# EAGLE design 8085-lock-schematic (EAGLE 7.3.0)
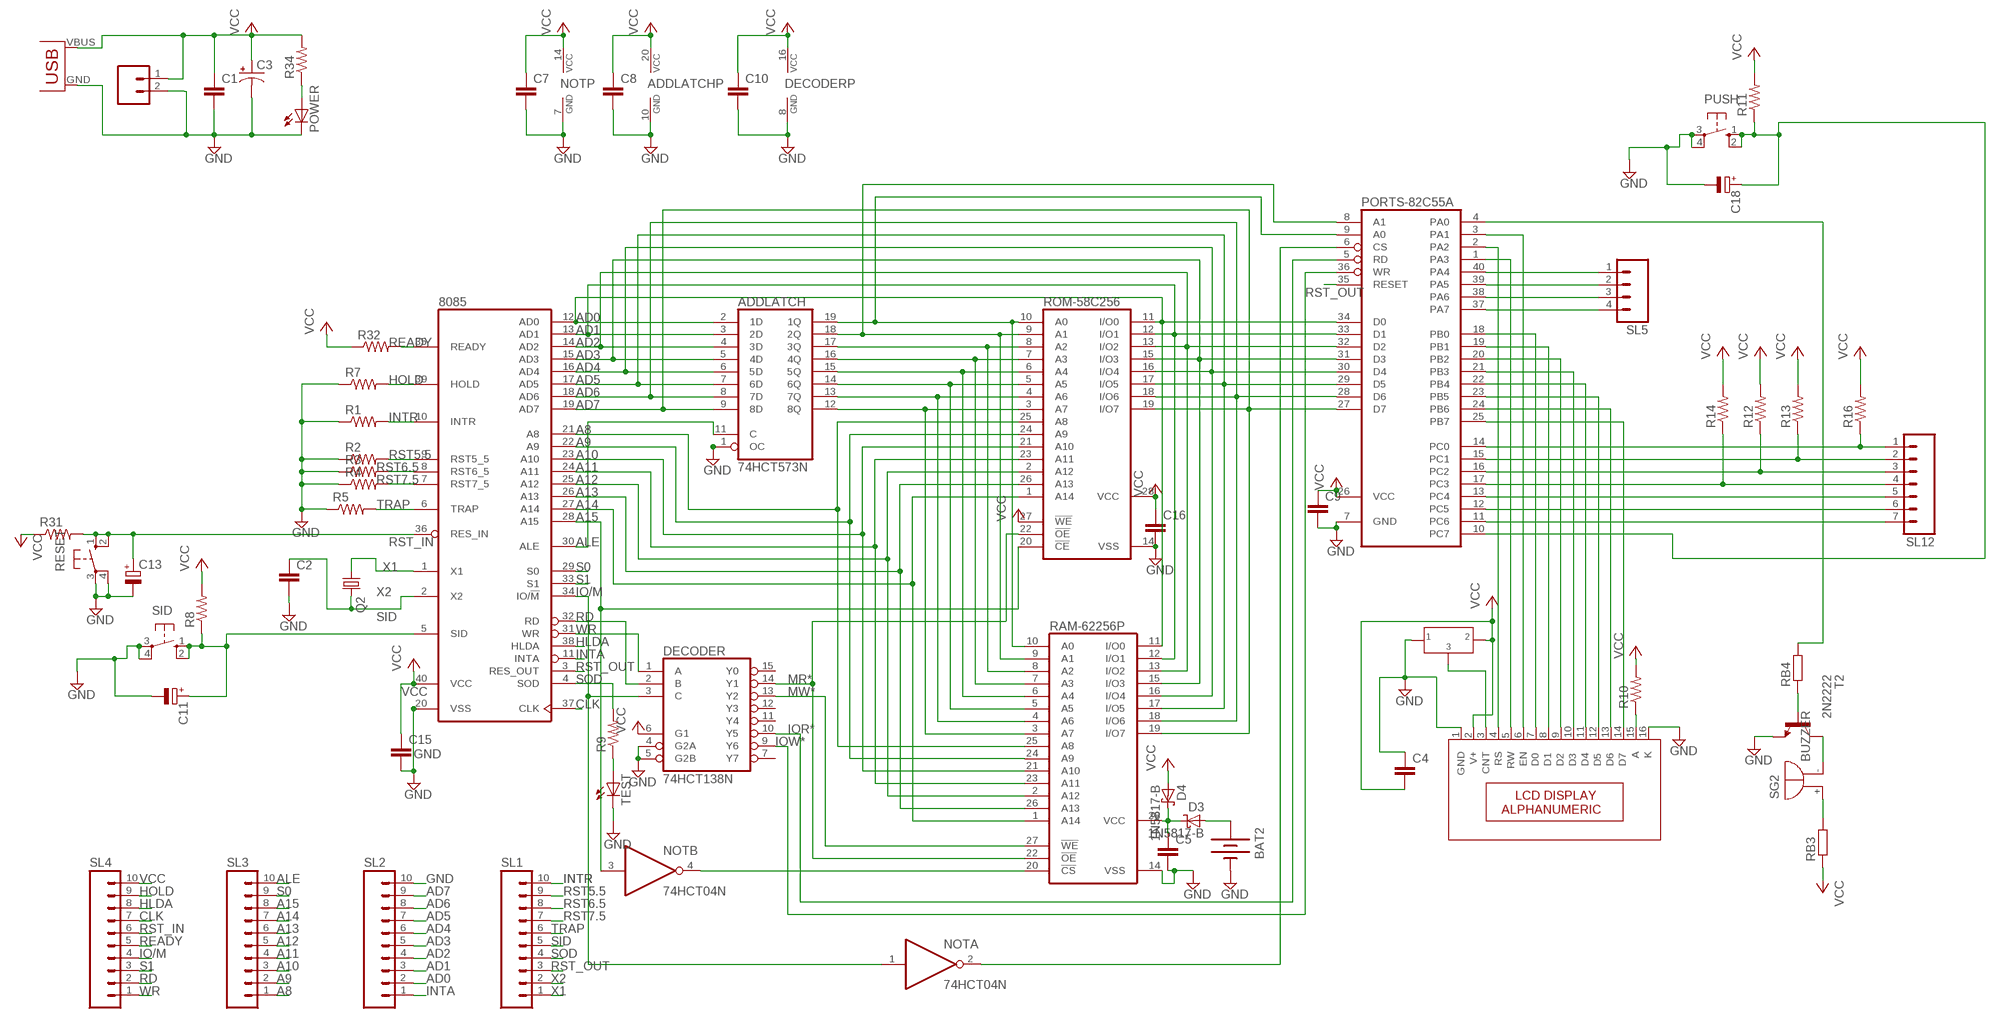
[diagram p0: schematic, sheet 1]

## Parts
8085  8085  [DIL40]
ADDLATCH  74HCT573N  [DIL20]
BAT2  BATTERY20PTH  [BATTCOM_20MM_PTH]
C1  C-EU025-024X044  [C025-024X044]
C2  C-EU025-024X044  [C025-024X044]
C3  CPOL-USE2.5-5  [E2,5-5]
C4  C-EU025-024X044  [C025-024X044]
C5  C-EU025-024X044  [C025-024X044]
C7  C-EU025-024X044  [C025-024X044]
C8  C-EU025-024X044  [C025-024X044]
C9  C-EU025-024X044  [C025-024X044]
C10  C-EU025-024X044  [C025-024X044]
C11  CPOL-EUE2.5-6  [E2,5-6]
C13  CPOL-EUE2.5-6  [E2,5-6]
C15  C-EU025-024X044  [C025-024X044]
C16  C-EU025-024X044  [C025-024X044]
C18  CPOL-EUE2.5-6  [E2,5-6]
D3  1N5817-B  [DO41-7.6]
D4  1N5817-B  [DO41-7.6]
DECODER  74HCT138N  [DIL16]
NOT  74HCT04N  [DIL14]
PORTS-82C55A  82C55A  [DIL40]
POWER  LED5MM  [LED5MM]
PUSH  10-XX  [B3F-10XX]
Q2  CRYSTALHC49US  [HC49US]
R1  R-US_0207/7  [0207/7]
R2  R-US_0207/7  [0207/7]
R3  R-US_0207/7  [0207/7]
R4  R-US_0207/7  [0207/7]
R5  R-US_0207/7  [0207/7]
R6  PRESET_LR  [PRESET_LR]
R7  R-US_0207/7  [0207/7]
R8  R-US_0207/7  [0207/7]
R9  R-US_0207/7  [0207/7]
R10  R-US_0207/7  [0207/7]
R11  R-US_0207/7  [0207/7]
R12  R-US_0207/7  [0207/7]
R13  R-US_0207/7  [0207/7]
R14  R-US_0207/7  [0207/7]
R16  R-US_0207/7  [0207/7]
R31  R-US_0207/7  [0207/7]
R32  R-US_0207/7  [0207/7]
R34  R-US_0207/7  [0207/7]
RAM-62256P  62256P  [DIL28-6]
RB3  R-EU_0204/7  [0204/7]
RB4  R-EU_0204/7  [0204/7]
RESET  10-XX  [B3F-10XX]
ROM-58C256  58C256P  [DIL28-6]
SG2  BUZZER  [F/TMB]
SID  10-XX  [B3F-10XX]
SL1  M10  [10P]
SL2  M10  [10P]
SL3  M10  [10P]
SL4  M10  [10P]
SL5  M04  [04P]
SL12  M07  [07P]
T2  2N2222  [TO18]
TEST  LED5MM  [LED5MM]
U$1  M02  [02P]
U$2  USB(POWER)  [USB(POWER)]
U$3  LCD-16X2  [16X2-LCD-WITH-MOUNT]

## Nets
A8: 8085.21(A8) RAM-62256P.25(A8) ROM-58C256.25(A8) SL3.1
A9: 8085.22(A9) RAM-62256P.24(A9) ROM-58C256.24(A9) SL3.2
A10: 8085.23(A10) RAM-62256P.21(A10) ROM-58C256.21(A10) SL3.3
A11: 8085.24(A11) RAM-62256P.23(A11) ROM-58C256.23(A11) SL3.4
A12: 8085.25(A12) RAM-62256P.2(A12) ROM-58C256.2(A12) SL3.5
A13: 8085.26(A13) RAM-62256P.26(A13) ROM-58C256.26(A13) SL3.6
A14: 8085.27(A14) RAM-62256P.1(A14) ROM-58C256.1(A14) SL3.7
A15: 8085.28(A15) NOT.3(B:I) ROM-58C256.20(!CE) SL3.8
AD0: 8085.12(AD0) ADDLATCH.2(1D) PORTS-82C55A.34(D0) RAM-62256P.11(I/O0) ROM-58C256.11(I/O0) SL2.2
AD1: 8085.13(AD1) ADDLATCH.3(2D) PORTS-82C55A.33(D1) RAM-62256P.12(I/O1) ROM-58C256.12(I/O1) SL2.3
AD2: 8085.14(AD2) ADDLATCH.4(3D) PORTS-82C55A.32(D2) RAM-62256P.13(I/O2) ROM-58C256.13(I/O2) SL2.4
AD3: 8085.15(AD3) ADDLATCH.5(4D) PORTS-82C55A.31(D3) RAM-62256P.15(I/O3) ROM-58C256.15(I/O3) SL2.5
AD4: 8085.16(AD4) ADDLATCH.6(5D) PORTS-82C55A.30(D4) RAM-62256P.16(I/O4) ROM-58C256.16(I/O4) SL2.6
AD5: 8085.17(AD5) ADDLATCH.7(6D) PORTS-82C55A.29(D5) RAM-62256P.17(I/O5) ROM-58C256.17(I/O5) SL2.7
AD6: 8085.18(AD6) ADDLATCH.8(7D) PORTS-82C55A.28(D6) RAM-62256P.18(I/O6) ROM-58C256.18(I/O6) SL2.8
AD7: 8085.19(AD7) ADDLATCH.9(8D) PORTS-82C55A.27(D7) RAM-62256P.19(I/O7) ROM-58C256.19(I/O7) SL2.9
ALE: 8085.30(ALE) ADDLATCH.11(C) SL3.10
BUZZER: PORTS-82C55A.4(PA0) RB4.2
CLK: 8085.37(CLK) SL4.7
GND [GND]: 8085.20(VSS) ADDLATCH.1(OC) ADDLATCH.10(GND) BAT2.2(-) C1.2 C2.2 C3.- C4.1 C5.2 C7.2 C8.2 C9.2 C10.2 C11.- C13.- C15.2 C16.2 C18.- DECODER.4(G2A) DECODER.5(G2B) DECODER.8(GND) NOT.7(P:GND) PORTS-82C55A.7(GND) POWER.K(C) PUSH.3(P) PUSH.4(P1) R1.1 R2.1 R3.1 R4.1 R5.1 R6.P$1 R7.1 RAM-62256P.14(VSS) RESET.3(P) RESET.4(P1) ROM-58C256.14(VSS) SID.3(P) SID.4(P1) SL2.10 T2.1(E) TEST.K(C) U$1.2 U$2.GND U$3.1(GND) U$3.16(K)
HLDA: 8085.38(HLDA) SL4.8
HOLD: 8085.39(HOLD) R7.2 SL4.9
INTA: 8085.11(INTA) SL2.1
INTR: 8085.10(INTR) R1.2 SL1.10
IO/M: 8085.34(IO/!M) DECODER.3(C) NOT.1(A:I) SL4.4
IOR*: DECODER.10(Y5) PORTS-82C55A.5(RD)
IOW*: DECODER.9(Y6) PORTS-82C55A.36(WR)
MR*: DECODER.14(Y1) RAM-62256P.22(!OE) ROM-58C256.22(!OE)
MW*: DECODER.13(Y2) RAM-62256P.27(!WE)
N$1: PORTS-82C55A.14(PC0) R16.1 SL12.1
N$2: PORTS-82C55A.15(PC1) R13.1 SL12.2
N$3: PORTS-82C55A.16(PC2) R12.1 SL12.3
N$4: PORTS-82C55A.17(PC3) R14.1 SL12.4
N$5: PORTS-82C55A.13(PC4) SL12.5
N$6: PORTS-82C55A.12(PC5) SL12.6
N$7: PORTS-82C55A.11(PC6) SL12.7
N$8: PORTS-82C55A.40(PA4) SL5.1
N$9 [VCC]: R10.1 U$3.15(A)
N$10: R6.P$3 U$3.3(CNT)
N$11: C5.1 D3.C D4.C RAM-62256P.28(VCC)
N$12: ADDLATCH.17(3Q) RAM-62256P.8(A2) ROM-58C256.8(A2)
N$13: ADDLATCH.16(4Q) RAM-62256P.7(A3) ROM-58C256.7(A3)
N$14: ADDLATCH.15(5Q) RAM-62256P.6(A4) ROM-58C256.6(A4)
N$15: ADDLATCH.14(6Q) RAM-62256P.5(A5) ROM-58C256.5(A5)
N$16: ADDLATCH.13(7Q) RAM-62256P.4(A6) ROM-58C256.4(A6)
N$17: ADDLATCH.12(8Q) RAM-62256P.3(A7) ROM-58C256.3(A7)
N$18: PORTS-82C55A.39(PA5) SL5.2
N$19: PORTS-82C55A.38(PA6) SL5.3
N$20: PORTS-82C55A.37(PA7) SL5.4
N$23: PORTS-82C55A.25(PB7) U$3.14(D7)
N$25: NOT.2(A:O) PORTS-82C55A.6(CS)
N$26: PORTS-82C55A.2(PA2) U$3.4(RS)
N$28: PORTS-82C55A.1(PA3) U$3.5(RW)
N$37: PORTS-82C55A.24(PB6) U$3.13(D6)
N$43: PORTS-82C55A.23(PB5) U$3.12(D5)
N$44: POWER.A R34.1
N$45: PORTS-82C55A.22(PB4) U$3.11(D4)
N$46: PORTS-82C55A.21(PB3) U$3.10(D3)
N$51: PORTS-82C55A.20(PB2) U$3.9(D2)
N$52: PORTS-82C55A.19(PB1) U$3.8(D1)
N$53: PORTS-82C55A.18(PB0) U$3.7(D0)
N$54: PORTS-82C55A.3(PA1) U$3.6(EN)
N$59: R9.1 TEST.A
N$60: NOT.4(B:O) RAM-62256P.20(!CS)
N$65: ADDLATCH.19(1Q) PORTS-82C55A.9(A0) RAM-62256P.10(A0) ROM-58C256.10(A0)
N$67: ADDLATCH.18(2Q) PORTS-82C55A.8(A1) RAM-62256P.9(A1) ROM-58C256.9(A1)
N$84: BAT2.1(+) D3.A
N$105: RB4.1 T2.2(B)
N$106: SG2.- T2.3(C)
N$107: RB3.2 SG2.+
RD: 8085.32(RD) DECODER.2(B) SL4.2
READY: 8085.35(READY) R32.2 SL4.5
RST5.5: 8085.9(RST5_5) R2.2 SL1.9
RST6.5: 8085.8(RST6_5) R3.2 SL1.8
RST7.5: 8085.7(RST7_5) R4.2 SL1.7
RST_IN: 8085.36(RES_IN) C13.+ R31.2 RESET.1(S) RESET.2(S1) SL4.6
RST_OUT: 8085.3(RES_OUT) PORTS-82C55A.35(RESET) SL1.3
S0: 8085.29(S0) SL3.9
S1: 8085.33(S1) SL4.3
SID [GND]: 8085.5(SID) C11.+ R8.1 SID.1(S) SID.2(S1) SL1.5
SID1 [GND]: C18.+ PORTS-82C55A.10(PC7) PUSH.1(S) PUSH.2(S1) R11.1
SOD: 8085.4(SOD) R9.2 SL1.4
TRAP: 8085.6(TRAP) R5.2 SL1.6
VCC [VCC]: 8085.40(VCC) ADDLATCH.20(VCC) C1.1 C3.+ C4.2 C7.1 C8.1 C9.1 C10.1 C15.1 C16.1 D4.A DECODER.6(G1) DECODER.16(VCC) NOT.14(P:VCC) PORTS-82C55A.26(VCC) R6.P$2 R8.2 R10.2 R11.2 R12.2 R13.2 R14.2 R16.2 R31.1 R32.1 R34.2 RB3.1 ROM-58C256.27(!WE) ROM-58C256.28(VCC) SL4.10 U$1.1 U$2.VBUS(VCC) U$3.2(V+)
WR: 8085.31(WR) DECODER.1(A) SL4.1
X1: 8085.1(X1) Q2.1 SL1.1
X2: 8085.2(X2) C2.1 Q2.2 SL1.2
Unconnected: DECODER.7(Y7) DECODER.11(Y4) DECODER.12(Y3) DECODER.15(Y0) NOT.5(C:I) NOT.6(C:O) NOT.8(D:O) NOT.9(D:I) NOT.10(E:O) NOT.11(E:I) NOT.12(F:O) NOT.13(F:I)

## Library data of the parts
8085 = micro-intel:8085: MICROCOMPUTER/PERIPHERAL DEVICE; OC_FARNELL: unknown; OC_NEWARK: unknown
ADDLATCH = 74xx-eu:74*573: 8-bit D latch BUS DRIVER
BAT2 = SparkFun-Electromechanical:BATTERY: Battery Holders Various common sizes : AA, AAA, 18650 (PRT-12895), 20mm coin cell and 12mm coin cell. 20MM_4LEGS, BATT-10373
C1 C2 C4 C5 C7-C10 C15 C16 = rcl:C-EU: CAPACITOR, European symbol
C3 = 01_adafruit:CPOL-US: POLARIZED CAPACITOR, American symbol
C11 C13 C18 = resistor:CPOL-EU: POLARIZED CAPACITOR, European symbol
D3 D4 = diode:1N581*: 1.0A SCHOTTKY BARRIER RECTIFIER Source: http://www.diodes.com/datasheets/ds23001.pdf
DECODER = 74xx-eu:74*138: 3-line to 8-line DECODER/DEMULTIPLEXER
NOT = 74xx-eu:74*04: Hex INVERTER
PORTS-82C55A = micro-intel:82C55A: MICROCOMPUTER/PERIPHERAL DEVICE; MF: INTERSIL; MPN: IP82C55AZ; OC_FARNELL: 1562050; OC_NEWARK: 79K6939
POWER TEST = CEDTv79:LED
PUSH SID = CEDTv79:10-XX: OMRON SWITCH
Q2 = CEDT:CRYSTAL: Crystals Various standard crystals. Proven footprints. Spark Fun Electronics SKU : COM-00534
R1-R5 R7-R14 R16 R31 R32 R34 = rcl:R-US_: RESISTOR, American symbol
R6 = CEDT_JANUARY_2015:PRESET_LR
RAM-62256P = memory-hitachi:62256P: MEMORY; OC_FARNELL: unknown; OC_NEWARK: unknown
RB3 RB4 = rcl:R-EU_: RESISTOR, European symbol
RESET = CEDT:10-XX: OMRON SWITCH
ROM-58C256 = memory-hitachi:58C256P: MEMORY; MPN: HN58C256AP85E; OC_FARNELL: 1496447; OC_NEWARK: 61M6616
SG2 = CEDT_JANUARY_2015_v5:BUZZER: BUZZER Source: Buerklin; OC_FARNELL: unknown; OC_NEWARK: unknown
SL1-SL4 = con-amp-quick:M10: AMP QUICK CONNECTOR; OC_FARNELL: unknown; OC_NEWARK: unknown
SL5 = con-amp-quick:M04: AMP QUICK CONNECTOR; OC_FARNELL: unknown; OC_NEWARK: unknown
SL12 = con-amp-quick:M07: AMP QUICK CONNECTOR; OC_FARNELL: unknown; OC_NEWARK: unknown
T2 = transistor:2N2222: NPN TRANSISTOR
U$1 = con-amp-quick:M02: AMP QUICK CONNECTOR; OC_FARNELL: unknown; OC_NEWARK: unknown
U$2 = CEDT_JANUARY_2015_v5:USB(POWER)
U$3 = MSP PROJECT LIBRARY:LCD-16X2

## Net classes
0 default: width 0.406 mm, clearance 0.205 mm
1 VCC: width 0.61 mm, clearance 0.205 mm to class 0, clearance 0.205 mm
2 GND: width 0.61 mm, clearance 0.205 mm to class 0, clearance 0.205 mm to class 1, clearance 0.205 mm

## Board
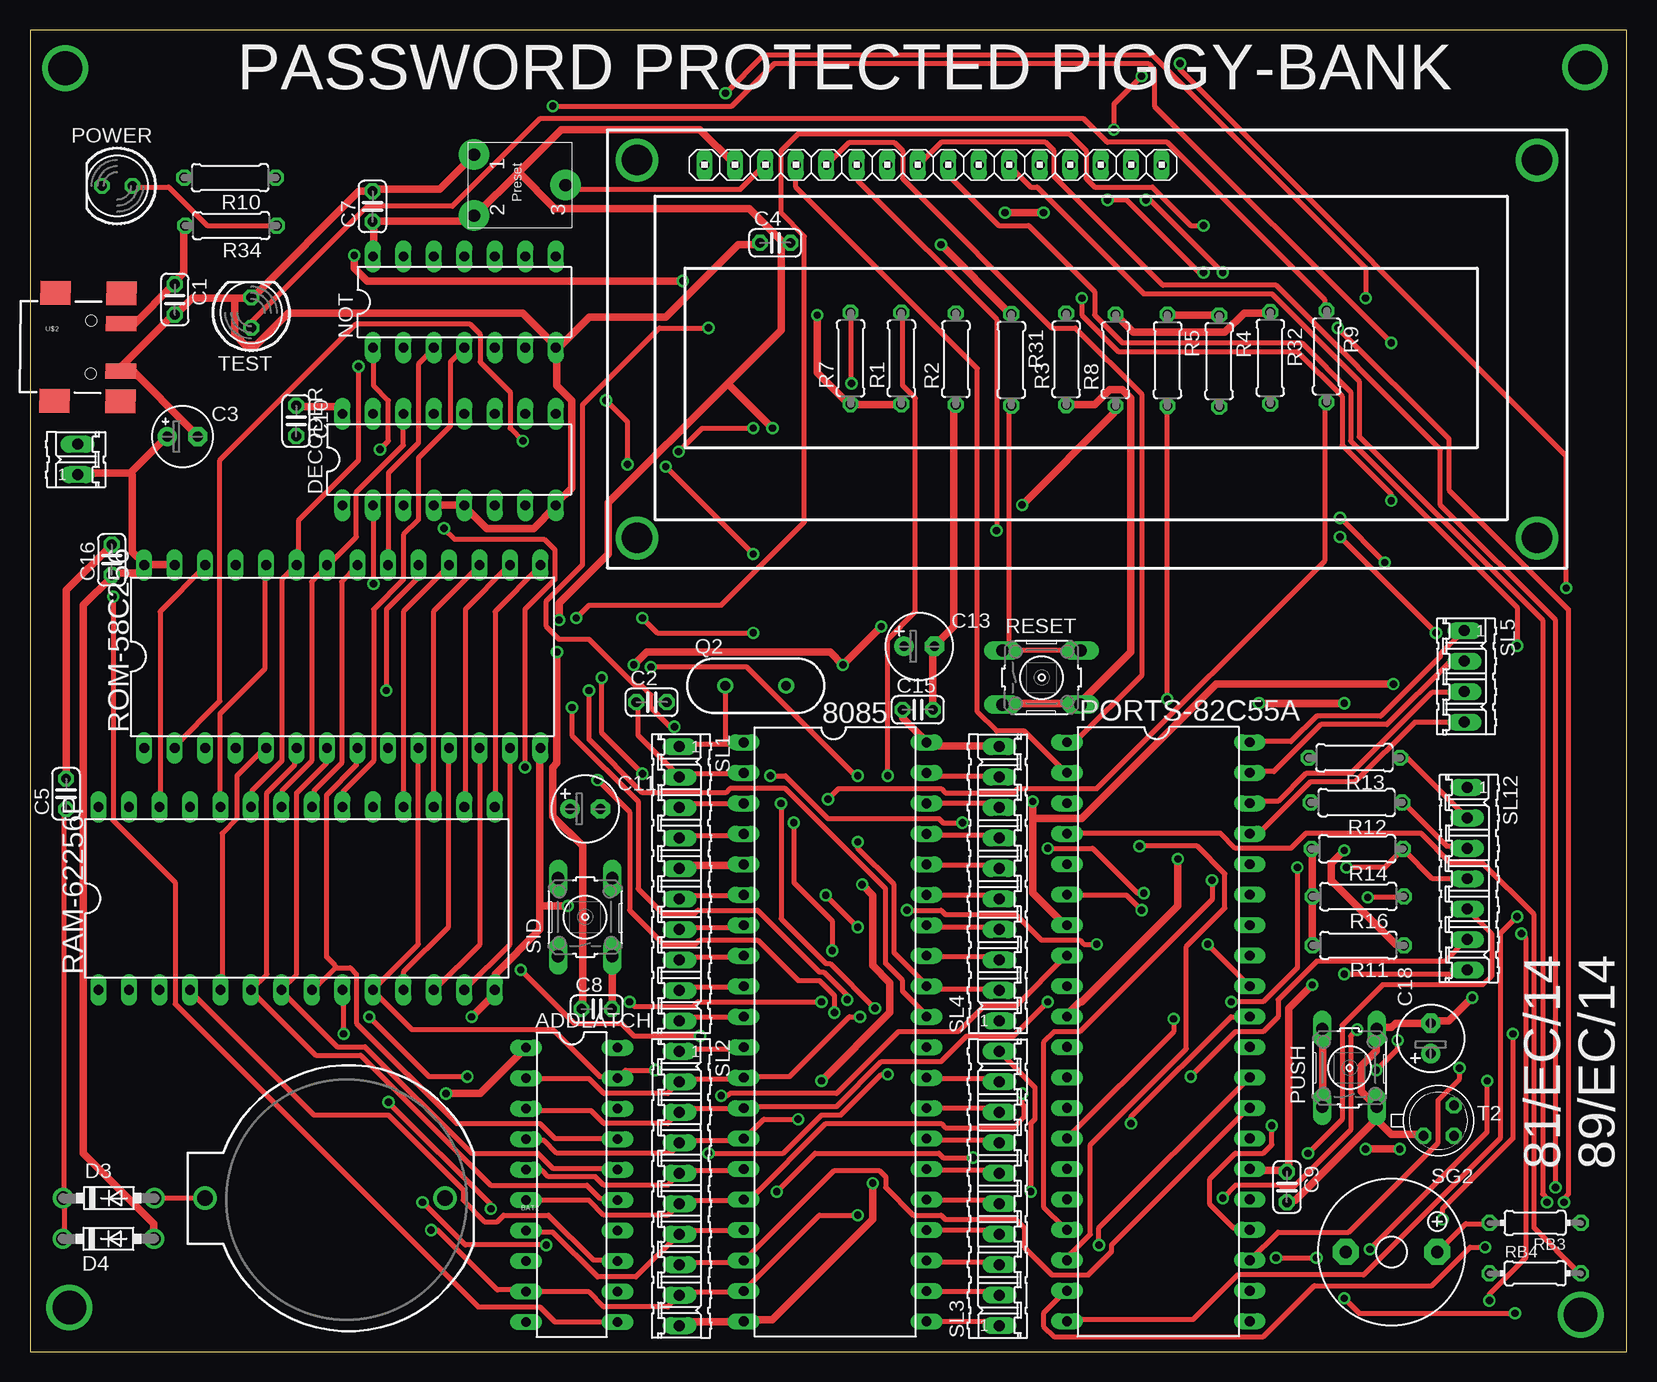
[diagram p1: board, top side]
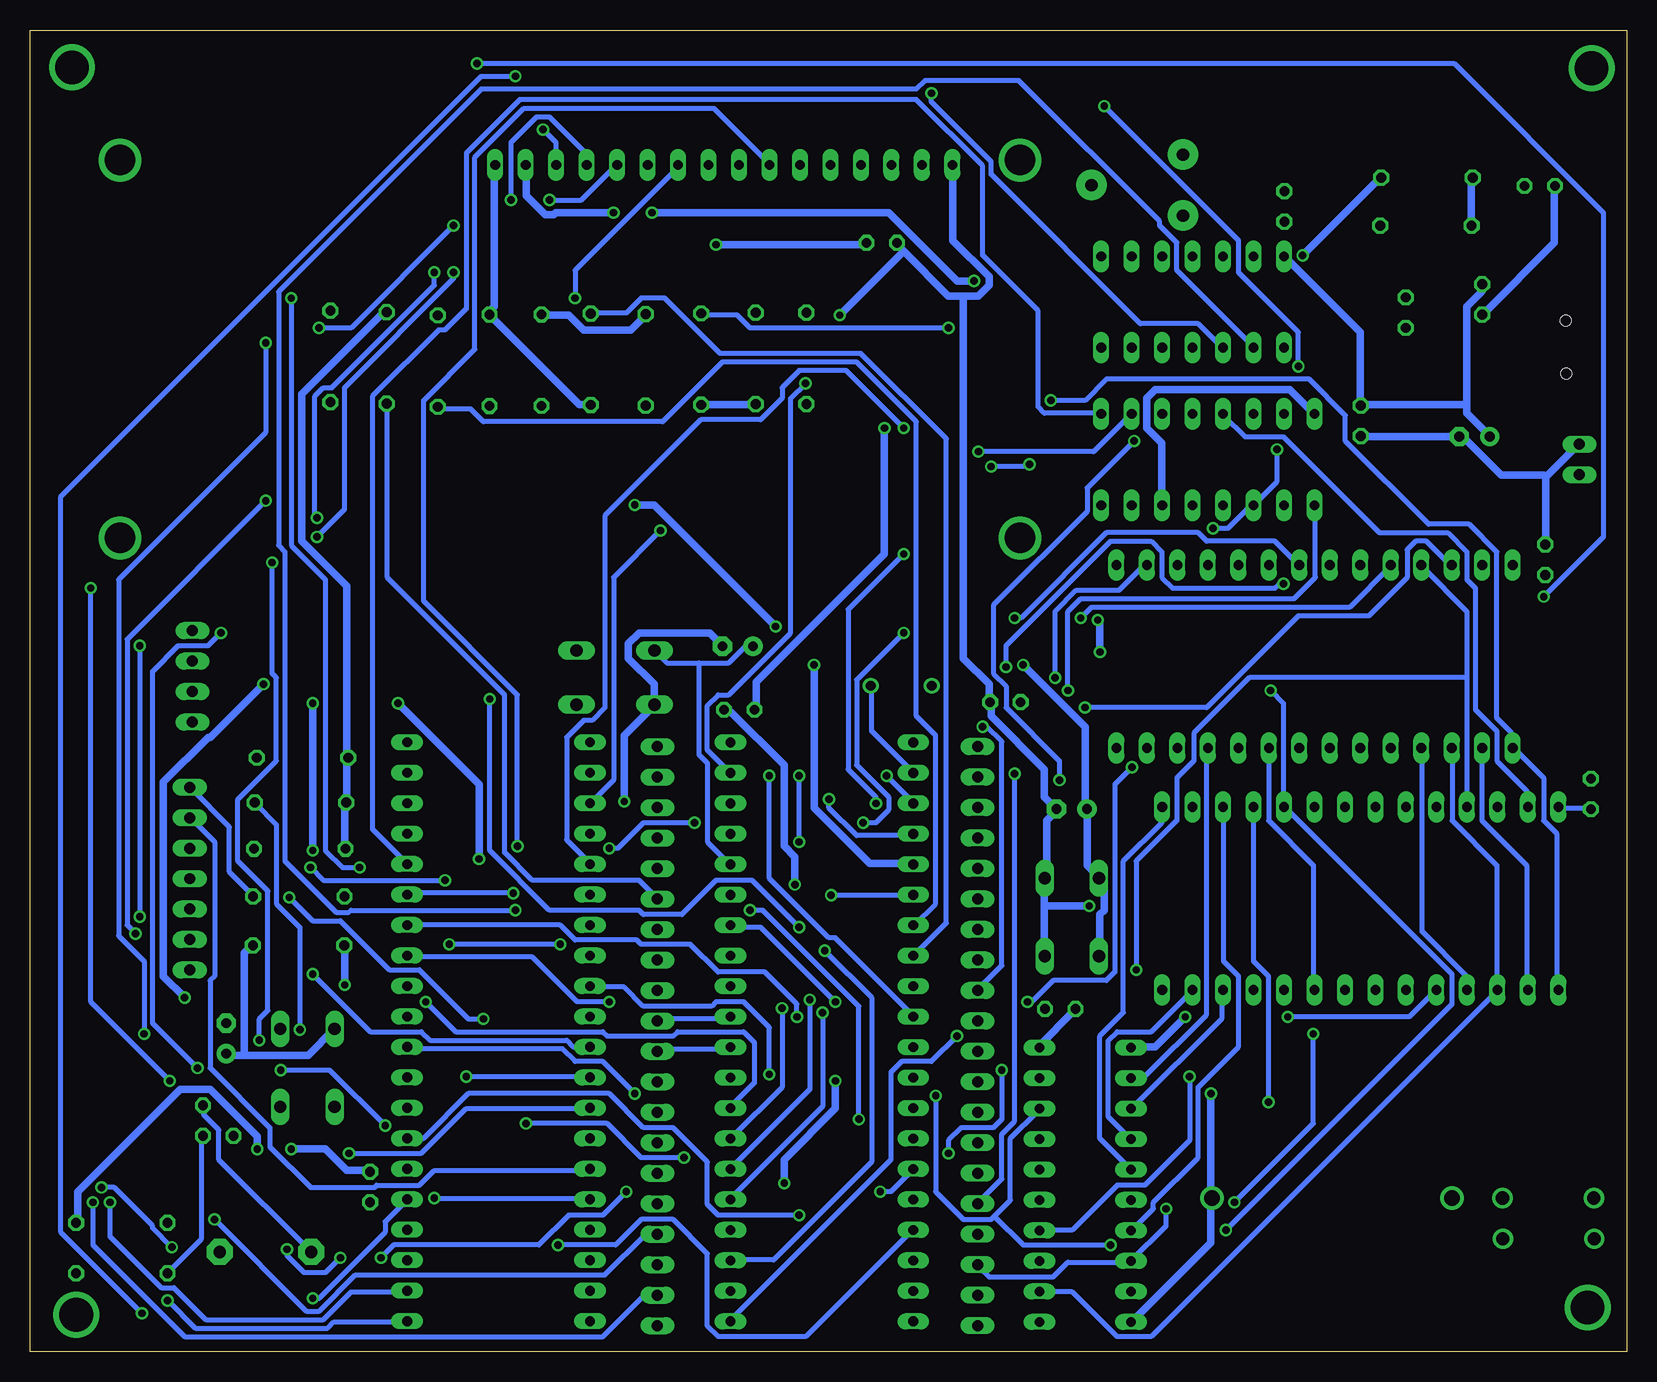
[diagram p2: board, bottom side, seen from below]

Size 133.08 x 110.18 mm. Coordinates in mm from the lower left corner, seen from the top.
Outline: 0,0 133.08,0 133.08,110.18 0,110.18 0,0
Copper layers (1*16): Top 0.035mm / dielectric 1.5mm / Bottom 0.035mm
Design rules "default *": minimum track width 10mil, minimum drill 24mil, track to track 12mil, track to pad 12mil, pad to pad 12mil, via to via 12mil, smd to smd 12mil, copper to edge 40mil, drill to drill 8mil, minimum pad ring 10mil, minimum via ring 8mil, stop-mask expansion 4mil, vias tented up to drill 0mil, thermal gap 10mil

### Footprints (pad centres in the part's own frame; a part is rotated, then mirrored left to right if it is on the bottom)
DIL40 = drill 0.813 long: 1 -24.13,-7.62; 2 -21.59,-7.62; 3 -19.05,-7.62; 4 -16.51,-7.62; 5 -13.97,-7.62; 6 -11.43,-7.62; 7 -8.89,-7.62; 8 -6.35,-7.62; 9 -3.81,-7.62; 10 -1.27,-7.62; 11 1.27,-7.62; 12 3.81,-7.62; 13 6.35,-7.62; 14 8.89,-7.62; 15 11.43,-7.62; 16 13.97,-7.62; 17 16.51,-7.62; 18 19.05,-7.62; 19 21.59,-7.62; 20 24.13,-7.62; 21 24.13,7.62; 22 21.59,7.62; 23 19.05,7.62; 24 16.51,7.62; 25 13.97,7.62; 26 11.43,7.62; 27 8.89,7.62; 28 6.35,7.62; 29 3.81,7.62; 30 1.27,7.62; 31 -1.27,7.62; 32 -3.81,7.62; 33 -6.35,7.62; 34 -8.89,7.62; 35 -11.43,7.62; 36 -13.97,7.62; 37 -16.51,7.62; 38 -19.05,7.62; 39 -21.59,7.62; 40 -24.13,7.62
DIL20 = drill 0.813 long: 1 -11.43,-3.81; 2 -8.89,-3.81; 3 -6.35,-3.81; 4 -3.81,-3.81; 5 -1.27,-3.81; 6 1.27,-3.81; 7 3.81,-3.81; 8 6.35,-3.81; 9 8.89,-3.81; 10 11.43,-3.81; 11 11.43,3.81; 12 8.89,3.81; 13 6.35,3.81; 14 3.81,3.81; 15 1.27,3.81; 16 -1.27,3.81; 17 -3.81,3.81; 18 -6.35,3.81; 19 -8.89,3.81; 20 -11.43,3.81
BATTCOM_20MM_PTH = drill 1.3: 1 11.85,0; 2 -8.15,0
C025-024X044 = drill 0.813 octagon: 1 -1.27,0; 2 1.27,0
E2,5-5 = drill 0.813 pad 1.6: + -1.27,0 | drill 0.813 pad 1.6 octagon: - 1.27,0
E2,5-6 = drill 0.813 pad 1.6: + -1.27,0 | drill 0.813 pad 1.6 octagon: - 1.27,0
DO41-7.6 = drill 1.1 pad 1.7: A 3.81,0; C -3.81,0
DIL16 = drill 0.813 long: 1 -8.89,-3.81; 2 -6.35,-3.81; 3 -3.81,-3.81; 4 -1.27,-3.81; 5 1.27,-3.81; 6 3.81,-3.81; 7 6.35,-3.81; 8 8.89,-3.81; 9 8.89,3.81; 10 6.35,3.81; 11 3.81,3.81; 12 1.27,3.81; 13 -1.27,3.81; 14 -3.81,3.81; 15 -6.35,3.81; 16 -8.89,3.81
DIL14 = drill 0.813 long: 1 -7.62,-3.81; 2 -5.08,-3.81; 3 -2.54,-3.81; 4 0,-3.81; 5 2.54,-3.81; 6 5.08,-3.81; 7 7.62,-3.81; 8 7.62,3.81; 9 5.08,3.81; 10 2.54,3.81; 11 0,3.81; 12 -2.54,3.81; 13 -5.08,3.81; 14 -7.62,3.81
LED5MM = drill 0.813 octagon: A -1.27,0; K 1.27,0
B3F-10XX = drill 1.016 long: 1 -3.251,2.261; 2 3.251,2.261; 3 -3.251,-2.261; 4 3.251,-2.261
HC49US = drill 0.813: 1 -2.54,0; 2 2.54,0
0207/7 = drill 0.813 octagon: 1 -3.81,0; 2 3.81,0
PRESET_LR = drill 1.016 pad 2.54: P$1 -2.54,-3.81; P$2 2.54,-3.81; P$3 0,3.81
DIL28-6 = drill 0.813 long: 1 -16.51,-7.62; 2 -13.97,-7.62; 3 -11.43,-7.62; 4 -8.89,-7.62; 5 -6.35,-7.62; 6 -3.81,-7.62; 7 -1.27,-7.62; 8 1.27,-7.62; 9 3.81,-7.62; 10 6.35,-7.62; 11 8.89,-7.62; 12 11.43,-7.62; 13 13.97,-7.62; 14 16.51,-7.62; 15 16.51,7.62; 16 13.97,7.62; 17 11.43,7.62; 18 8.89,7.62; 19 6.35,7.62; 20 3.81,7.62; 21 1.27,7.62; 22 -1.27,7.62; 23 -3.81,7.62; 24 -6.35,7.62; 25 -8.89,7.62; 26 -11.43,7.62; 27 -13.97,7.62; 28 -16.51,7.62
0204/7 = drill 0.813 octagon: 1 -3.81,0; 2 3.81,0
F/TMB = drill 1.016 pad 2.159 octagon: + 3.81,0; - -3.81,0
10P = drill 0.914 long: 1 -11.43,0; 2 -8.89,0; 3 -6.35,0; 4 -3.81,0; 5 -1.27,0; 6 1.27,0; 7 3.81,0; 8 6.35,0; 9 8.89,0; 10 11.43,0
04P = drill 0.914 long: 1 -3.81,0; 2 -1.27,0; 3 1.27,0; 4 3.81,0
07P = drill 0.914 long: 1 -7.62,0; 2 -5.08,0; 3 -2.54,0; 4 0,0; 5 2.54,0; 6 5.08,0; 7 7.62,0
TO18 = drill 0.813 octagon: 1 -1.27,-1.27; 2 1.27,-1.27; 3 1.27,1.27
02P = drill 0.914 long: 1 -1.27,0; 2 1.27,0
USB(POWER) = smd 2.54 x 1.27: GND 2.5,-1.981; VBUS 2.5,1.981 | smd 2.5 x 2: GND@1 -3,-4.5; GND@2 -3,4.5; GND@3 2.5,4.5; GND@4 2.5,-4.5 | hole 0.9: 0,2.2; 0,-2.2
16X2-LCD-WITH-MOUNT = drill 0.813 long: 1 8.12,33.608; 2 10.66,33.608; 3 13.2,33.608; 4 15.74,33.608; 5 18.28,33.608; 6 20.82,33.608; 7 23.36,33.608; 8 25.9,33.608; 9 28.44,33.608; 10 30.98,33.608; 11 33.52,33.608; 12 36.06,33.608; 13 38.6,33.608; 14 41.14,33.608; 15 43.68,33.608; 16 46.22,33.608 | drill 2.54: P$1 2.5,34; P$2 2.5,2.5; P$3 77.5,2.5; P$4 77.5,34

### Placement (x,y rotation side)
8085  67.09,26.66 270 top
ADDLATCH  45.15,13.91 270 top
BAT2  26.45,12.79 180 top
C1  12.06,87.72 270 top
C2  51.8,54.15 0 top
C3  12.7,76.28 0 top
C4  62.1,92.44 0 top
C5  3,46.5 90 top
C7  28.55,95.47 90 top
C8  47.23,28.57 0 top
C9  104.74,13.73 270 top
C10  22.18,77.59 270 top
C11  46.27,45.24 0 top
C13  74.1,58.8 0 top
C15  73.98,53.52 0 top
C16  6.81,66.02 90 top
C18  116.72,26.12 90 top
D3  6.57,12.8 0 top
D4  6.54,9.41 0 top
DECODER  34.92,74.38 0 top
NOT  36.2,87.5 0 top
PORTS-82C55A  94.03,26.67 270 top
POWER  7.27,97.17 180 top
PUSH  109.96,23.66 90 top
Q2  60.47,55.52 0 top
R1  72.61,82.8 90 top
R2  77.15,82.75 90 top
R3  86.35,82.73 90 top
R4  99.09,82.58 270 top
R5  94.79,82.65 270 top
R6  40.81,97.25 270 top
R7  68.38,82.81 90 top
R8  90.46,82.66 90 top
R9  108.05,82.97 270 top
R10  16.67,97.87 180 top
R11  110.69,33.87 180 top
R12  110.54,45.77 180 top
R13  110.37,49.51 180 top
R14  110.6,41.92 180 top
R16  110.68,37.95 180 top
R31  81.78,82.68 270 top
R32  103.36,82.84 270 top
R34  16.75,93.87 180 top
RAM-62256P  22.23,37.78 0 top
RB3  125.43,10.74 180 top
RB4  125.43,6.53 0 top
RESET  84.3,56.2 0 top
ROM-58C256  26.03,57.95 0 top
SG2  113.46,8.31 0 top
SID  46.27,36.23 90 top
SL1  54.12,39.01 270 top
SL2  54.12,13.61 270 top
SL3  80.79,13.61 90 top
SL4  80.79,39.01 90 top
SL5  119.54,56.29 270 top
SL12  119.77,39.43 270 top
T2  117.39,19.26 0 top
TEST  18.43,86.61 90 top
U$1  3.96,74.38 90 top
U$2  5.08,83.73 359.4 top
U$3  48.09,65.33 0 top

### Tracks (layer width: path | path; a pad name or v marks a point on that pad's centre or on a via)
A8  (via drill 0.61)
  Top 0.406: 8085.21 74.85,2.49 80.54,2.49 80.72,2.31 SL3.1 | v55.83,26.31 50.32,26.31 49.25,27.38 45.34,27.38 v40.89,31.83
  Bottom 0.406: 13.34,56.19 13.34,61.7 17.07,65.43 ROM-58C256.25 | 13.34,56.19 RAM-62256P.25 | v55.83,26.31 57.96,24.18 60.45,24.18 61.34,23.29 61.34,16 74.68,2.67 8085.21 | v40.89,31.83 40.89,40.89 37.52,44.27 37.52,47.83 36.09,49.25 36.09,51.56 31.47,56.19 13.34,56.19
A9  (via drill 0.61)
  Top 0.406: 8085.22 74.85,4.98 80.54,4.98 80.72,4.8 SL3.2 | RAM-62256P.24 15.82,45.52 15.82,53.16 19.56,56.9 19.56,65.43 ROM-58C256.24 | v127.84,12.45 127.84,12.8 128.19,13.16 128.19,61.87 118.24,71.83 118.24,76.1 v108.99,85.34 | v97.79,93.88 96.72,93.88 93.52,97.08 88.72,97.08 88.01,97.79 88.01,100.1 86.59,101.52 64.01,101.52 62.59,100.1 62.59,94.94 64.54,92.99 64.54,69.16 57.61,62.23 46.58,62.23 v45.52,61.16
  Bottom 0.406: v127.84,12.45 127.84,8.89 120.19,1.25 85.34,1.25 81.97,4.62 80.9,4.62 SL3.2 | v108.99,85.34 106.32,85.34 v97.79,93.88 | v45.52,61.16 44.63,62.05 23.11,62.05 19.74,65.43 ROM-58C256.24
A10  (via drill 0.61)
  Top 0.406: 8085.23 74.85,7.47 80.54,7.47 80.72,7.29 SL3.3 | RAM-62256P.21 23.65,45.52 23.65,46.76 25.96,49.07 25.96,64.19 27.2,65.43 ROM-58C256.21 | v66.85,33.43 66.85,35.92 63.65,39.12 v63.65,44.09 | v60.27,59.92 52.27,59.92 v51.03,61.16
  Bottom 0.406: v66.85,33.43 62.94,29.52 62.94,15.82 71.12,7.64 74.68,7.64 8085.23 | v63.65,44.09 62.59,44.09 61.52,45.16 61.52,46.23 64.19,48.9 64.19,56.01 v60.27,59.92 | v51.03,61.16 50.49,61.16 43.38,68.28 35.74,68.28 35.03,67.56 29.34,67.56 27.38,65.61 ROM-58C256.21
A11  (via drill 0.61)
  Top 0.406: 8085.24 74.85,10.13 80.54,10.13 80.72,9.96 SL3.4 | RAM-62256P.23 18.49,45.52 18.49,46.76 20.98,49.25 20.98,64.36 22.05,65.43 ROM-58C256.23 22.4,65.61 22.4,69.34 27.38,74.32 v27.38,82.14 | v117.7,11.02 117.7,11.91 123.57,17.78 v123.57,26.49 | v113.44,84.1 93.7,103.83 93.7,106.86 93.17,107.39 62.05,107.39 58.5,103.83 v43.56,103.83
  Bottom 0.406: v117.7,11.02 110.06,3.38 108.99,3.38 105.97,6.4 85.17,6.4 81.79,9.78 80.9,9.78 SL3.4 | v123.57,26.49 123.57,32.54 125.7,34.67 125.7,64.36 113.44,76.63 v113.44,84.1 | v43.56,103.83 32.36,92.63 32.36,89.97 27.38,84.99 v27.38,82.14
A12  (via drill 0.61)
  Top 0.406: 8085.25 74.85,12.62 80.54,12.62 80.72,12.45 SL3.5 | v67.03,28.27 67.03,29.69 65.79,30.94 64.01,30.94 60.63,34.31 55.83,34.31 55.47,33.96 52.81,33.96 49.96,36.8 49.96,44.98 v47.3,47.65 | v41.07,75.92 40.01,76.99 40.01,80.01 37.52,82.5 37.52,84.81 36.63,85.7 27.2,85.7 15.82,74.32 15.82,54.23 12.09,50.49 ROM-58C256.2
  Bottom 0.406: RAM-62256P.2 8.36,30.23 8.36,40.54 12.09,44.27 12.09,50.32 ROM-58C256.2 | v67.03,28.27 67.03,20.45 74.68,12.8 8085.25 | v47.3,47.65 47.3,49.25 51.74,53.7 51.74,55.47 52.81,56.54 52.81,62.23 44.98,70.05 44.98,72.01 v41.07,75.92
A13  (via drill 0.61)
  Top 0.406: 8085.26 74.85,15.11 80.54,15.11 80.72,14.94 SL3.6 | RAM-62256P.26 10.85,45.52 10.85,61.7 14.58,65.43 ROM-58C256.26 | v68.1,29.34 68.1,29.69 66.14,31.65 65.79,31.65 60.63,36.8 55.65,36.8 55.3,36.45 52.81,36.45 50.67,38.58 50.67,45.87 45.16,51.38 v45.16,53.7
  Bottom 0.406: v68.1,29.34 68.1,21.87 74.68,15.29 8085.26 | v45.16,53.7 35.03,53.7 27.38,61.34 21.51,61.34 18.31,64.54 18.31,66.85 17.6,67.56 16.71,67.56 14.76,65.61 ROM-58C256.26
A14  (via drill 0.61)
  Top 0.406: 8085.27 74.85,17.6 80.54,17.6 80.72,17.42 SL3.7 | v70.41,28.63 66.67,32.36 66.32,32.36 62.59,36.09 v62.59,45.7 | v52.98,73.79 v60.27,66.5 | v49.78,73.97 49.78,77.52 v48.01,79.3
  Bottom 0.406: RAM-62256P.1 5.87,30.23 5.87,43.2 6.93,44.27 6.93,47.83 9.42,50.32 ROM-58C256.1 9.6,50.49 9.6,51.56 10.85,52.81 10.85,66.67 13.16,68.99 16.54,68.99 23.47,75.92 23.47,78.05 26.49,81.08 43.38,81.08 45.16,79.3 v48.01,79.3 | v70.41,28.63 70.41,22.05 74.68,17.78 8085.27 | v62.59,45.7 62.59,46.23 64.9,48.54 64.9,61.87 v60.27,66.5 | v52.98,73.79 49.96,73.79 v49.78,73.97
A15  (via drill 0.61)
  Top 0.406: 8085.28 74.85,20.27 80.54,20.27 80.72,20.09 SL3.8 | ROM-58C256.20 29.87,65.61 29.87,73.25 32.36,75.74 32.36,82.32 33.6,83.57 NOT.3 | v100.1,29.16 102.77,29.16 105.61,32 v105.61,40.36 | v111.3,87.83 111.3,90.32 93.52,108.1 61.16,108.1 v57.96,104.9
  Bottom 0.406: v100.1,29.16 97.61,26.67 85.34,26.67 84.99,26.31 79.48,26.31 79.12,26.67 73.61,26.67 72.72,25.78 72.72,22.4 74.68,20.45 8085.28 | v105.61,40.36 107.04,40.36 108.46,41.78 108.46,64.36 111.3,67.21 v111.3,87.83 | v57.96,104.9 57.96,104.19 52.98,99.21 52.98,98.15 40.54,85.7 35.74,85.7 33.78,83.74 NOT.3
AD0  (via drill 0.61)
  Top 0.406: RAM-62256P.11 31.11,31.65 34.85,35.38 34.85,50.32 ROM-58C256.11 | ADDLATCH.2 41.43,22.76 46.58,22.76 47.83,21.51 53.16,21.51 54.05,22.4 SL2.2 54.23,22.58 54.41,22.76 59.38,22.76 8085.12 59.56,22.94 63.3,22.94 68.28,27.91 v69.16,27.91
  Bottom 0.406: PORTS-82C55A.34 88.9,35.56 87.66,34.31 82.5,34.31 82.14,33.96 78.05,33.96 75.74,31.65 71.83,31.65 69.16,28.98 v69.16,27.91 | ROM-58C256.11 35.03,50.32 35.03,28.09 40.18,22.94 41.25,22.94 ADDLATCH.2
AD1  (via drill 0.61)
  Top 0.406: ROM-58C256.12 37.52,50.32 37.52,33.96 33.78,30.23 RAM-62256P.12 | v84.81,29.16 81.97,26.31 78.05,26.31 75.92,24.18 70.94,24.18 67.21,20.45 59.56,20.45 8085.13 59.38,20.27 54.41,20.27 54.23,20.09 SL2.3 54.05,19.91 53.16,19.02 47.83,19.02 46.76,20.09 41.43,20.09 ADDLATCH.3
  Bottom 0.406: ADDLATCH.3 41.25,20.27 33.78,27.74 33.78,30.05 RAM-62256P.12 | v84.81,29.16 87.48,29.16 91.21,32.89 101.52,32.89 PORTS-82C55A.33
AD2  (via drill 0.61)
  Top 0.406: ADDLATCH.4 41.43,17.6 42.85,17.6 43.92,16.54 53.34,16.54 54.05,17.25 SL2.4 54.05,17.6 59.38,17.6 8085.14 59.56,17.78 61.16,19.38 v64.01,19.38 | v98.15,33.96 101.52,30.58 PORTS-82C55A.32 | v88.9,33.96 87.83,33.96 87.48,34.31 84.28,34.31 82.14,36.45 76.28,36.45 75.92,36.8 v73.08,36.8 | ROM-58C256.13 40.01,50.32 40.01,33.96 36.27,30.23 RAM-62256P.13
  Bottom 0.406: RAM-62256P.13 36.27,30.05 39.65,26.67 42.49,26.67 43.2,25.96 43.2,19.56 41.43,17.78 ADDLATCH.4 | v88.9,33.96 v98.15,33.96 | v73.08,36.8 72.01,36.8 64.01,28.8 v64.01,19.38
AD3  (via drill 0.61)
  Top 0.406: RAM-62256P.15 38.76,45.52 38.76,61.7 42.49,65.43 ROM-58C256.15 | ADDLATCH.5 41.43,15.11 42.67,15.11 43.2,14.58 47.12,14.58 47.83,13.87 53.16,13.87 54.05,14.76 SL2.5 54.23,14.94 54.41,15.11 59.38,15.11 8085.15 | v91.75,19.02 91.75,19.56 100.1,27.91 101.52,27.91 PORTS-82C55A.31 | v78.59,16.18 76.1,16.18 75.74,16.54 65.43,16.54 v62.23,13.34
  Bottom 0.406: v91.75,19.02 84.99,19.02 82.14,16.18 v78.59,16.18 | v62.23,13.34 61.34,13.34 59.56,15.11 8085.15 | RAM-62256P.15 38.76,45.34 38.76,44.09 41.96,40.89 41.96,28.27 43.92,26.31 43.92,17.78 41.43,15.29 ADDLATCH.5
AD4  (via drill 0.61)
  Top 0.406: RAM-62256P.16 36.27,45.52 36.27,61.87 39.83,65.43 ROM-58C256.16 | ADDLATCH.6 41.43,12.62 46.58,12.62 47.83,11.38 53.16,11.38 54.05,12.27 SL2.6 54.23,12.45 54.41,12.62 59.38,12.62 8085.16 59.56,12.8 60.1,12.8 66.32,19.02 75.92,19.02 76.28,18.67 81.97,18.67 82.86,19.56 82.86,20.45 82.68,20.62 v82.68,21.51 | v47.65,56.19 47.65,51.56 v51.03,48.18
  Bottom 0.406: v82.68,21.51 85.34,24.18 87.66,24.18 88.72,25.25 101.52,25.25 PORTS-82C55A.30 | v47.65,56.19 47.65,61.7 45.87,63.48 42.32,63.48 40.36,65.43 40.01,65.43 ROM-58C256.16 | v51.03,48.18 51.03,19.2 52.09,18.14 52.09,14.4 54.05,12.45 SL2.6
AD5  (via drill 0.61)
  Top 0.406: RAM-62256P.17 33.6,45.52 33.6,61.7 37.34,65.43 ROM-58C256.17 | ADDLATCH.7 41.43,9.96 43.56,9.96 47.3,6.22 50.49,6.22 54.05,9.78 SL2.7 54.23,9.96 54.41,10.13 59.38,10.13 8085.17 | v89.08,8.89 89.08,10.31 101.52,22.76 PORTS-82C55A.29
  Bottom 0.406: v89.08,8.89 84.28,8.89 82.14,11.02 79.48,11.02 76.63,8.18 76.63,2.13 75.74,1.25 68.45,1.25 59.56,10.13 8085.17 | RAM-62256P.17 33.6,45.34 33.6,32.54 32.36,31.29 32.36,25.43 35.74,22.05 35.74,16.18 39.47,12.45 39.47,11.91 41.25,10.13 ADDLATCH.7
AD6  (via drill 0.61)
  Top 0.406: RAM-62256P.18 31.11,61.7 34.85,65.43 ROM-58C256.18 | SL2.8 54.23,7.29 54.41,7.47 59.38,7.47 8085.18 59.56,7.64 67.03,15.11 70.76,15.11 71.3,14.58 71.3,13.69 73.61,11.38 75.92,11.38 76.28,11.02 82.14,11.02 82.86,10.31 82.86,8.71 85.17,6.4 88.19,6.4 90.14,8.36 90.14,8.89 101.52,20.27 PORTS-82C55A.28 | v29.87,20.8 38.41,12.27 v38.41,11.91
  Bottom 0.406: SL2.8 54.05,7.11 53.16,6.22 47.83,6.22 46.58,7.47 41.43,7.47 ADDLATCH.8 38.41,10.49 v38.41,11.91 | RAM-62256P.18 31.11,32.54 29.87,31.29 v29.87,20.8
AD7  (via drill 0.61)
  Top 0.406: v29.69,55.12 29.69,61.87 32.36,64.54 32.36,65.43 ROM-58C256.19 | v68.99,11.38 65.79,11.38 59.56,5.16 8085.19 59.38,4.98 54.41,4.98 54.23,4.8 SL2.9 54.05,4.62 53.16,3.73 47.83,3.73 46.58,4.98 41.43,4.98 ADDLATCH.9 41.25,5.16 38.94,5.16 33.96,10.13 v33.43,10.13
  Bottom 0.406: v29.69,55.12 28.63,54.05 28.63,45.52 RAM-62256P.19 28.45,45.34 14.58,31.47 14.58,28.98 v33.43,10.13 | PORTS-82C55A.27 100.28,17.78 96.55,21.51 84.81,21.51 81.97,18.67 79.48,18.67 76.63,15.82 76.63,12.27 75.74,11.38 v68.99,11.38
ALE  (via drill 0.61)
  Top 0.406: v6.93,62.94 6.93,44.27 12.09,39.12 12.09,28.98 37.34,3.73 42.49,3.73 43.74,2.49 48.9,2.49 ADDLATCH.11 | v95.83,107.39 95.83,106.86 128.02,74.68 v128.02,63.65 | v121.44,22.58 121.44,18.31 v111.66,8.53 | v103.83,7.82 v107.21,7.82 | v83.39,13.34 83.39,19.02 83.74,19.38 83.74,22.05 80.9,24.89 SL3.10
  Bottom 0.406: v6.93,62.94 1.96,67.92 1.96,94.94 14.4,107.39 v95.83,107.39 | v128.02,63.65 128.02,29.16 v121.44,22.58 | v111.66,8.53 111.66,8 110.24,6.58 108.46,6.58 v107.21,7.82 | v103.83,7.82 102.77,8.89 90.68,8.89 88.19,11.38 85.34,11.38 v83.39,13.34 | 8085.30 74.85,25.25 80.54,25.25 80.72,25.07 SL3.10
BUZZER
  Top 0.406: PORTS-82C55A.4 86.41,43.2 99.21,43.2 100.46,41.96 105.08,41.96 106.32,43.2 115.93,43.2 118.42,40.72 121.08,40.72 125.35,36.45 125.35,10.31 129.08,6.58 RB4.2
CLK
  Top 0.406: 8085.37 74.85,43.03 80.54,43.03 80.72,42.85 SL4.7
GND  (via drill 0.61)
  Top 0.61: C8.2 48.54,28.63 48.54,32.89 SID.3 | 42.49,37.16 42.49,50.32 ROM-58C256.14 | 42.49,37.16 42.49,35.2 38.76,31.47 38.76,30.23 RAM-62256P.14 38.76,29.87 v36.8,27.91 | v34.67,21.51 37.52,21.51 41.25,25.25 ADDLATCH.1 | 42.49,37.16 v44.81,37.16 | DECODER.4 33.78,70.59 36.09,70.59 DECODER.5 36.27,70.41 38.05,68.63 41.96,68.63 43.74,70.41 DECODER.8 43.92,70.76 45.16,72.01 45.16,79.3 43.92,80.54 43.92,83.57 NOT.7 | C4.1 60.81,92.28 59.03,92.28 52.98,86.23 46.58,86.23 44.09,83.74 NOT.7 | C5.2 3.02,47.83 3.02,63.48 6.76,67.21 C16.2 | R6.P$1 36.98,99.75 34.14,96.9 28.63,96.9 C7.2 28.27,96.72 27.38,96.72 18.67,88.01 TEST.K 18.31,87.83 17.07,87.83 | 17.07,87.83 13.51,87.83 12.27,86.59 C1.2 11.91,86.41 7.64,82.14 7.64,81.79 U$2.GND 8,82.32 13.87,76.45 C3.- | 17.07,87.83 17.07,84.81 17.96,83.92 18.85,83.92 21.51,86.59 41.07,86.59 43.74,83.92 NOT.7 | R4.1 99.03,86.41 94.94,86.41 R5.1 | C9.2 104.9,12.62 105.44,12.62 112.19,19.38 112.19,20.27 PUSH.3 | T2.1 116.1,18.14 113.44,18.14 112.37,19.2 PUSH.3 | PUSH.3 112.01,20.62 110.95,21.69 110.95,23.82 112.19,25.07 112.19,26.67 PUSH.4 112.37,27.03 113.44,27.03 113.79,27.38 116.64,27.38 C18.- 116.99,27.56 118.24,27.56 v120.19,29.52 | v83.57,45.87 83.57,44.45 | 83.57,44.45 83.57,38.23 86.23,35.56 PORTS-82C55A.7 | RESET.3 81.08,54.05 87.48,54.05 RESET.4 87.66,54.23 91.75,58.32 91.75,79.48 91.03,80.19 89.97,80.19 88.72,78.94 86.41,78.94 R3.1 | R1.1 72.54,78.94 68.45,78.94 R7.1 68.1,79.12 65.61,81.61 v65.61,86.41 | SL2.10 54.23,2.31 54.41,2.49 59.38,2.49 8085.20 59.74,2.67 61.87,2.67 70.23,11.02 v70.23,14.05 | C15.2 75.21,53.52 75.21,58.67 C13.- 75.56,59.03 76.99,60.45 76.99,78.77 R2.1
  Top 0.61: v65.96,22.58 71.65,28.27 71.65,30.76 70.23,32.18 70.23,38.05 v69.34,38.94 | v113.61,55.65 98.86,55.65 87.66,44.45 83.57,44.45
  Bottom 0.61: 48.54,37.16 48.54,39.29 SID.4 48.36,39.65 48.36,44.27 47.65,44.98 C11.- 47.65,45.34 48.54,46.23 48.54,48.54 52.98,52.98 52.98,54.05 C2.2 53.16,54.41 53.16,55.65 55.3,57.78 55.3,88.01 | 48.54,37.16 48.54,33.07 SID.3 | ADDLATCH.10 41.25,2.49 34.67,9.07 34.67,12.62 BAT2.2 34.67,12.98 v34.67,21.51 | v36.8,27.91 39.29,25.43 41.25,25.43 ADDLATCH.1 | v44.81,37.16 48.54,37.16 | 55.3,88.01 56.54,88.01 60.27,91.75 | 55.3,88.01 54.05,88.01 53.16,88.9 53.16,89.61 56.19,92.63 56.19,98.86 U$3.1 | 60.27,91.75 60.81,92.28 C4.1 | C10.2 22.05,76.28 14.05,76.28 C3.- 13.69,76.28 10.49,73.08 6.93,73.08 6.76,72.9 | 6.76,72.9 4.09,75.56 U$1.2 | 6.76,72.9 6.76,67.39 C16.2 | POWER.K 6.04,97.08 6.04,92.46 11.91,86.59 C1.2 | R3.1 86.41,78.94 87.3,78.94 94.77,86.41 R5.1 94.77,86.77 94.41,87.12 94.41,98.86 U$3.16 | v83.57,45.87 83.57,51.38 81.08,53.87 RESET.3 81.08,54.23 81.08,55.65 83.21,57.78 83.21,59.03 82.32,59.92 76.45,59.92 75.39,58.85 C13.- | R2.1 76.99,78.94 72.72,78.94 R1.1 | v70.23,14.05 70.23,16 65.96,20.27 v65.96,22.58 | v69.34,38.94 69.34,41.25 70.23,42.14 70.23,48.9 74.68,53.34 75.21,53.34 C15.2 | v120.19,29.52 121.97,31.29 121.97,47.47 118.24,51.21 118.06,51.21 v113.61,55.65 | v65.61,86.41 60.27,91.75
HLDA
  Top 0.406: 8085.38 74.85,45.7 80.54,45.7 80.72,45.52 SL4.8
HOLD  (via drill 0.61)
  Top 0.406: v68.45,80.72 68.45,86.59 R7.2 | SL4.9 80.72,48.01 75.03,48.01 74.85,48.18 8085.39
  Bottom 0.406: v68.45,80.72 69.7,79.48 69.7,59.92 74.85,54.76 75.74,54.76 76.63,53.87 76.63,50.14 74.85,48.36 8085.39
INTA
  Top 0.406: 8085.11 59.38,25.25 54.41,25.25 54.23,25.07 SL2.1
INTR  (via drill 0.61)
  Top 0.406: 8085.10 59.38,27.91 54.41,27.91 54.23,27.74 SL1.10 | v71.48,48.01 71.48,59.38 73.79,61.7 73.79,79.48 72.72,80.54 72.72,86.59 R1.2
  Bottom 0.406: v71.48,48.01 71.48,39.47 66.5,34.49 65.96,34.49 59.56,28.09 8085.10
IO/M  (via drill 0.61)
  Top 0.406: 8085.34 74.85,35.38 80.54,35.38 80.72,35.2 SL4.4 | v29.16,75.21 29.87,75.92 29.87,79.3 28.63,80.54 28.63,83.57 NOT.1 | v65.96,29.16 55.65,29.16 55.3,28.8 50.32,28.8 v49.96,29.16 | v41.25,48.72 41.25,61.87 43.74,64.36 43.74,66.85 42.85,67.74 35.38,67.74 v34.49,68.63
  Bottom 0.406: v29.16,75.21 29.16,72.54 31.11,70.59 DECODER.3 31.29,70.59 33.25,68.63 v34.49,68.63 | v65.96,29.16 72.19,35.38 74.68,35.38 8085.34 | v49.96,29.16 49.61,29.16 47.83,30.94 43.38,30.94 42.67,31.65 42.67,47.3 v41.25,48.72
IOR*  (via drill 0.61)
  Top 0.406: v60.27,76.99 56.01,76.99 v54.05,75.03
  Bottom 0.406: v60.27,76.99 65.08,81.79 68.99,81.79 70.41,80.37 70.41,79.48 72.19,77.7 77.17,77.7 85.17,69.7 85.17,53.7 86.23,52.63 86.94,52.63 88.37,51.21 88.37,42.67 86.41,40.72 PORTS-82C55A.5 | v54.05,75.03 44.45,75.03 41.43,78.05 DECODER.10
IOW*
  Bottom 0.406: PORTS-82C55A.36 101.7,40.72 104.55,43.56 104.55,79.65 99.03,85.17 98.5,85.17 96.72,86.94 96.72,99.92 92.28,104.37 59.21,104.37 53.7,98.86 53.7,91.39 49.07,86.77 49.07,78.77 48.54,78.23 43.92,78.23 DECODER.9
MR*
  Top 0.406: RAM-62256P.22 20.98,45.52 20.98,46.76 23.47,49.25 23.47,64.19 24.71,65.43 ROM-58C256.22 24.89,65.61 27.2,67.92 27.2,71.65 31.11,75.56 DECODER.14
MW*
  Bottom 0.406: RAM-62256P.27 8.36,45.52 8.36,46.76 10.85,49.25 10.85,51.74 12.62,53.52 12.62,63.65 13.34,64.36 13.34,66.67 14.94,68.28 20.62,68.28 28.63,76.28 31.83,76.28 33.6,78.05 DECODER.13
N$1  (via drill 0.61)
  Top 0.406: v95.3,27.74 95.3,26.67 PORTS-82C55A.14 | v111.48,37.87 114.33,37.87 R16.1
  Bottom 0.406: v95.3,27.74 96.55,27.74 100.64,31.83 103.12,31.83 107.21,35.92 109.53,35.92 v111.48,37.87 | SL12.1 119.66,46.94 116.46,43.74 116.46,40.01 114.5,38.05 R16.1
N$2
  Top 0.406: R13.1 114.33,49.43 114.86,49.43 119.66,44.63 SL12.2
  Bottom 0.406: PORTS-82C55A.15 86.41,15.11 99.39,15.11 100.64,13.87 104.19,13.87 104.37,13.69 109.7,13.69 113.08,17.07 113.08,18.67 118.06,23.65 118.06,30.94 117.7,31.29 117.7,42.49 119.66,44.45 SL12.2
N$3  (via drill 0.61)
  Top 0.406: v99.39,12.8 100.46,13.87 104.19,13.87 104.37,13.69 105.26,13.69 110.06,18.49 110.06,26.31 v110.59,26.85 | SL12.3 119.66,42.14 118.06,42.14 114.5,45.7 R12.1
  Bottom 0.406: v99.39,12.8 86.41,12.8 PORTS-82C55A.16 | v110.59,26.85 110.59,35.38 112.55,37.34 112.55,43.92 114.33,45.7 R12.1
N$4  (via drill 0.61)
  Top 0.406: v98.5,39.29 98.5,37.69 87.48,26.67 85.34,26.67 84.45,25.78 84.45,12.09 86.23,10.31 PORTS-82C55A.17 | v109.7,40.36 112.9,40.36 114.33,41.78 R14.1 114.5,41.78 116.81,39.47 119.66,39.47 SL12.4
  Bottom 0.406: v98.5,39.29 108.64,39.29 v109.7,40.36
N$5  (via drill 0.61)
  Top 0.406: v106.5,16.54 109.35,19.38 109.35,27.2 112.72,30.58 121.08,30.58 121.79,31.29 121.79,34.85 119.84,36.8 SL12.5
  Bottom 0.406: v106.5,16.54 100.46,16.54 96.72,20.27 86.41,20.27 PORTS-82C55A.13
N$6  (via drill 0.61)
  Top 0.406: v96.72,22.94 100.46,26.67 102.77,26.67 104.01,27.91 104.01,29.34 107.21,32.54 117.88,32.54 119.66,34.31 SL12.6
  Bottom 0.406: v96.72,22.94 86.41,22.94 PORTS-82C55A.12
N$7  (via drill 0.61)
  Top 0.406: v109.53,31.47 119.48,31.47 119.66,31.65 SL12.7
  Bottom 0.406: v109.53,31.47 104.72,26.67 100.46,26.67 99.75,25.96 88.37,25.96 87.83,25.43 86.41,25.43 PORTS-82C55A.11
N$8
  Top 0.406: PORTS-82C55A.40 101.7,50.85 105.08,50.85 107.21,52.98 112.55,52.98 117.53,57.96 117.53,58.14 119.48,60.1 SL5.1
N$9  (via drill 0.61)
  Top 0.61: v27.03,91.39 27.03,90.32 28.09,89.26 v54.41,89.26 | v84.45,94.94 v81.25,94.94
  Bottom 0.61: v27.03,91.39 20.62,97.79 R10.1 | v54.41,89.26 55.83,89.26 61.52,94.94 v81.25,94.94 | v84.45,94.94 89.26,94.94 89.43,94.77 90.14,94.77 91.75,96.37 91.75,98.86 U$3.15
N$10
  Top 0.406: U$3.3 61.16,98.86 59.21,96.9 44.81,96.9 44.63,97.08 R6.P$3
N$11
  Top 0.406: D4.C 2.85,9.42 2.85,12.8 D3.C 2.85,12.98 2.85,45.16 C5.1
  Bottom 0.406: C5.1 3.02,45.34 5.69,45.34 RAM-62256P.28
N$12
  Top 0.406: 25.43,32 26.67,32 27.2,31.47 27.2,27.38 35.56,19.02 42.49,19.02 43.74,17.78 48.9,17.78 ADDLATCH.17 | 25.43,32 23.65,30.23 RAM-62256P.8 | ROM-58C256.8 27.2,50.32 27.2,48.9 24.71,46.41 24.71,32.89 25.43,32.18 25.43,32
N$13
  Top 0.406: ADDLATCH.16 48.9,15.29 43.56,15.29 42.32,16.54 36.8,16.54 27.91,25.43 25.6,25.43 20.98,30.05 RAM-62256P.7 20.98,30.23 22.23,31.47 22.23,46.58 24.71,49.07 24.71,50.32 ROM-58C256.7
N$14
  Top 0.406: ADDLATCH.15 48.9,12.8 47.47,12.8 46.41,13.87 38.41,13.87 27.56,24.71 23.82,24.71 18.49,30.05 RAM-62256P.6 18.49,30.23 19.74,31.47 19.74,46.58 22.05,48.9 22.05,50.32 ROM-58C256.6
N$15  (via drill 0.61)
  Top 0.406: RAM-62256P.5 16,30.23 16,43.2 17.25,44.45 17.25,48.01 19.56,50.32 ROM-58C256.5 | v36.45,22.94 33.25,22.94 v28.27,27.91
  Bottom 0.406: v36.45,22.94 36.45,17.6 40.18,13.87 42.49,13.87 46.23,10.13 48.9,10.13 ADDLATCH.14 | v28.27,27.91 18.14,27.91 16,30.05 RAM-62256P.5
N$16
  Top 0.406: ADDLATCH.13 48.9,7.64 46.94,7.64 43.2,11.38 39.47,11.38 38.94,10.85 37.87,10.85 36.09,12.62 36.09,13.51 29.87,19.74 23.65,19.74 13.34,30.05 RAM-62256P.4
  Bottom 0.406: RAM-62256P.4 13.34,31.29 17.07,35.03 17.07,50.32 ROM-58C256.4
N$17
  Bottom 0.406: ROM-58C256.3 14.58,50.32 14.58,44.27 10.85,40.54 10.85,30.23 RAM-62256P.3 10.85,30.05 39.65,1.25 42.49,1.25 46.23,4.98 48.9,4.98 ADDLATCH.12
N$18
  Top 0.406: PORTS-82C55A.39 101.7,48.36 103.66,48.36 107.57,52.27 113.08,52.27 118.24,57.43 119.48,57.43 SL5.2
N$19
  Top 0.406: PORTS-82C55A.38 101.7,45.87 104.01,45.87 106.32,48.18 110.06,48.18 116.81,54.94 119.48,54.94 SL5.3
N$20
  Top 0.406: PORTS-82C55A.37 101.7,43.2 102.41,43.2 106.68,47.47 110.41,47.47 115.39,52.45 119.48,52.45 SL5.4
N$21  (via drill 2.8 pad 2.54)
  other vias: 2.94,106.99
N$22  (via drill 2.8 pad 2.54)
  other vias: 129.58,107.06
N$23  (via drill 0.61)
  Top 0.406: v90.32,101.88 90.32,104.01 v92.63,106.32 | v123.75,3.2 110.77,3.2 v109.53,4.45
  Bottom 0.406: v90.32,101.88 89.26,100.81 89.26,99.03 U$3.14 | v92.63,106.32 95.48,106.32 130.5,71.3 130.5,9.96 v123.75,3.2 | v109.53,4.45 108.99,4.45 103.48,9.96 103.48,10.85 101.7,12.62 PORTS-82C55A.25
N$24  (via drill 2.8 pad 2.54)
  other vias: 129.22,3.08
N$25  (via drill 0.61)
  Top 0.406: v92.63,36.8 91.39,38.05 86.41,38.05 PORTS-82C55A.6
  Bottom 0.406: v92.63,36.8 106.32,36.8 106.5,36.63 107.57,36.63 111.84,40.89 111.84,66.67 112.37,67.21 112.37,88.37 95.48,105.26 59.21,105.26 58.5,105.97 50.67,105.97 38.94,94.23 38.94,93.88 37.52,92.46 37.52,90.14 31.11,83.74 NOT.2
N$26
  Top 0.406: U$3.4 63.83,98.86 63.83,97.08 78.94,81.97 78.94,53.34 80.54,51.74 82.86,51.74 86.23,48.36 PORTS-82C55A.2
N$27  (via drill 2.8 pad 2.54)
  other vias: 3.27,3.67
N$28
  Top 0.406: PORTS-82C55A.1 86.41,50.85 87.12,50.85 92.63,56.36 92.63,79.83 87.12,85.34 85.17,85.34 72.72,97.79 72.72,100.1 72.01,100.81 68.28,100.81 66.5,99.03 U$3.5
N$37  (via drill 0.61)
  Top 0.406: v92.99,96.01 93.34,96.01 v99.39,89.97 | v112.9,65.79 v109.17,69.52 | v113.97,25.96 113.97,25.25 v112.19,23.47 | v103.48,18.85 103.48,17.25 102.77,16.54 100.46,16.54 98.32,14.4 98.32,12.27 100.28,10.31 101.52,10.31 PORTS-82C55A.24
  Bottom 0.406: v92.99,96.01 92.99,100.81 90.86,102.95 89.79,102.95 86.77,99.92 86.77,99.03 U$3.13 | v99.39,89.97 99.39,88.9 107.92,80.37 108.64,80.37 109.35,79.65 109.35,69.7 v109.17,69.52 | v112.9,65.79 112.9,56.54 112.55,56.19 112.55,49.25 115.75,46.05 115.75,40.89 113.26,38.41 113.26,28.45 113.97,27.74 v113.97,25.96 | v112.19,23.47 108.1,23.47 v103.48,18.85
N$43  (via drill 0.61)
  Top 0.406: v89.79,96.01 91.39,96.01 97.43,89.97 v97.79,89.97 | v117.17,59.92 v109.17,67.92 | v119.13,23.65 119.13,22.76 117.35,20.98 117.35,17.42 109.88,9.96 104.01,9.96 101.7,7.64 PORTS-82C55A.23
  Bottom 0.406: v89.79,96.01 87.12,96.01 84.28,98.86 U$3.12 | v97.79,89.97 97.79,89.43 106.86,80.37 106.86,70.23 v109.17,67.92 | v117.17,59.92 118.24,58.85 120.73,58.85 122.86,56.72 122.86,27.38 v119.13,23.65
N$44
  Top 0.406: R34.1 20.45,93.88 14.76,93.88 11.56,97.08 8.71,97.08 POWER.A
N$45  (via drill 0.61)
  Top 0.406: v126.42,12.45 126.42,12.8 126.06,13.16 126.06,60.98 110.77,76.28 110.77,80.9 103.48,88.19 92.81,88.19 83.92,97.08 83.39,97.08 81.61,98.86 U$3.11
  Bottom 0.406: v126.42,12.45 126.42,9.6 122.15,5.33 121.08,5.33 118.42,2.67 108.64,2.67 106.32,4.98 101.7,4.98 PORTS-82C55A.22
N$46  (via drill 0.61)
  Top 0.406: v121.61,4.27 121.61,4.8 124.64,7.82 124.64,34.49 v124.28,34.85 | v113.44,70.94 113.44,71.48 109.35,75.56 109.35,79.65 105.61,83.39 90.68,83.39 87.66,86.41 v87.66,87.83
  Bottom 0.406: v121.61,4.27 119.3,1.96 108.28,1.96 107.75,2.49 101.7,2.49 PORTS-82C55A.21 | v124.28,34.85 124.99,35.56 124.99,59.38 v113.44,70.94 | v87.66,87.83 87.66,90.14 78.94,98.86 U$3.10
N$51  (via drill 0.61)
  Top 0.406: v123.93,36.27 122.5,34.85 122.5,17.78 111.12,6.4 100.64,6.4 96.9,2.67 86.41,2.67 PORTS-82C55A.20 | v123.93,58.85 123.93,62.05 110.06,75.92 110.06,80.01 105.97,84.1 91.03,84.1 88.72,86.41 88.72,88.37 83.21,93.88 80.72,93.88 76.63,97.97 76.63,98.86 U$3.9
  Bottom 0.406: v123.93,58.85 v123.93,36.27
N$52  (via drill 0.61)
  Top 0.406: v127.13,13.69 127.13,60.98 117.53,70.59 117.53,75.21 103.83,88.9 94.41,88.9 85.34,97.97 85.34,100.1 84.63,100.81 75.92,100.81 74.14,99.03 U$3.8 | v121.26,8.71 120.02,8.71 116.81,5.51 107.04,5.51 102.77,1.25 85.34,1.25 84.45,2.13 84.45,3.2 86.23,4.98 PORTS-82C55A.19
  Bottom 0.406: v127.13,13.69 126.06,13.69 122.86,10.49 122.86,10.31 v121.26,8.71
N$53  (via drill 0.61)
  Top 0.406: v92.46,42.14 97.26,42.14 99.57,39.83 99.57,36.98 96.37,33.78 96.37,25.25 88.37,17.25 88.37,9.78 86.23,7.64 PORTS-82C55A.18
  Bottom 0.406: v92.46,42.14 92.46,54.76 100.28,62.59 100.28,79.3 96.01,83.57 96.01,99.57 91.92,103.66 76.1,103.66 71.48,99.03 U$3.7
N$54  (via drill 0.61)
  Top 0.406: v80.54,68.45 80.54,86.06 68.99,97.61 68.99,98.86 U$3.6
  Bottom 0.406: v80.54,68.45 84.45,64.54 84.45,47.65 86.23,45.87 PORTS-82C55A.3
N$59
  Top 0.406: TEST.A 18.49,85.52 18.49,85.88 28.09,95.48 35.2,95.48 42.49,102.77 87.83,102.77 89.79,100.81 94.77,100.81 107.92,87.66 107.92,86.94 R9.1
N$60
  Top 0.406: RAM-62256P.20 26.14,45.52 26.14,46.76 28.63,49.25 28.63,61.87 31.11,64.36 31.11,68.1 32.36,69.34 32.36,74.5 35.03,77.17 35.03,82.5 36.09,83.57 NOT.4
N$65  (via drill 0.61)
  Top 0.406: ROM-58C256.10 32.36,50.32 32.36,33.96 28.63,30.23 RAM-62256P.10 28.63,30.05 31.83,26.85 43.56,26.85 47.47,22.94 48.9,22.94 ADDLATCH.19 49.07,22.94 49.61,23.47 v52.09,23.47 | v71.48,23.11 70.94,23.11 67.56,19.74 65.96,19.74 62.76,16.54 v56.54,16.54
  Bottom 0.406: v71.48,23.11 71.48,27.03 73.61,29.16 75.92,29.16 76.28,28.8 81.97,28.8 83.57,30.4 86.23,30.4 PORTS-82C55A.9 | v56.54,16.54 56.54,17.6 55.47,18.67 52.81,18.67 52.09,19.38 v52.09,23.47
N$67  (via drill 0.61)
  Top 0.406: v57.61,21.34 58.14,21.34 58.32,21.51 67.21,21.51 72.36,26.67 77.34,26.67 79.48,28.8 82.14,28.8 86.23,32.89 PORTS-82C55A.8 | v26.14,26.49 26.14,30.05 RAM-62256P.9 | v32.72,12.45 36.27,8.89 v43.03,8.89
  Bottom 0.406: RAM-62256P.9 26.14,30.23 26.14,40.54 29.87,44.27 29.87,50.32 ROM-58C256.9 | 52.72,11.29 52.98,11.02 55.3,11.02 57.61,13.34 v57.61,21.34 | 52.72,11.29 51.38,12.62 51.38,17.78 49.07,20.09 ADDLATCH.18 | v26.14,26.49 26.14,19.02 v32.72,12.45 | v43.03,8.89 50.32,8.89 52.72,11.29
N$84
  Top 0.406: D3.A 10.49,12.8 14.58,12.8 BAT2.1
N$105
  Bottom 0.406: T2.2 118.77,17.96 118.77,9.42 121.61,6.58 RB4.1
N$106
  Bottom 0.406: T2.3 118.59,20.45 118.59,19.74 117.35,18.49 117.35,16 109.7,8.36 SG2.-
N$107
  Top 0.406: RB3.2 121.61,10.67 119.66,10.67 117.35,8.36 SG2.+
RD  (via drill 0.61)
  Top 0.406: v28.63,64.01 28.63,70.41 DECODER.2 | v51.74,57.07 59.74,57.07 68.81,48.01 v68.99,48.01 | v68.99,42.49 68.99,41.96 72.01,38.94 72.01,33.25 74.68,30.58 8085.32 74.85,30.4 75.03,30.23 80.72,30.23 SL4.2
  Bottom 0.406: v28.63,64.01 28.98,64.01 29.34,63.65 37.87,63.65 38.76,64.54 38.76,66.67 39.65,67.56 43.03,67.56 51.74,58.85 v51.74,57.07 | v68.99,42.49 v68.99,48.01
READY
  Top 0.406: 8085.35 74.85,38.05 80.54,38.05 80.72,37.87 SL4.5
  Bottom 0.406: R32.2 103.3,78.94 103.3,64.54 93.52,54.76 93.52,41.6 91.21,39.29 82.32,39.29 80.9,37.87 SL4.5
RST5.5  (via drill 0.61)
  Top 0.406: 8085.9 59.38,30.4 54.41,30.4 54.23,30.23 SL1.9 | v56.54,85.34 52.45,85.34 46.05,78.94 46.05,65.61 43.03,62.59 43.03,60.45 44.09,59.38 46.58,59.38 50.49,55.47 51.03,55.47 51.74,54.76 51.74,53.7 53.34,52.09 v53.7,52.09
  Bottom 0.406: v56.54,85.34 73.08,85.34 74.14,86.41 76.99,86.41 R2.2 | v53.7,52.09 53.34,52.09 52.09,50.85 52.09,32.18 54.05,30.23 SL1.9
RST6.5
  Top 0.406: 8085.8 59.38,32.89 54.41,32.89 54.23,32.72 SL1.8
  Bottom 0.406: R3.2 86.23,86.59 83.39,86.59 82.14,87.83 80.19,87.83 75.56,83.21 63.83,83.21 56.72,76.1 56.72,35.74 59.38,33.07 8085.8
RST7.5
  Top 0.406: 8085.7 59.38,35.38 54.41,35.38 54.23,35.2 SL1.7
  Bottom 0.406: R4.2 99.03,78.59 96.37,78.59 95.3,77.52 80.37,77.52 75.39,82.5 64.19,82.5 59.21,77.52 59.21,52.98 57.61,51.38 57.61,37.34 59.38,35.56 8085.7
RST_IN
  Top 0.406: 8085.36 74.85,40.54 80.54,40.54 80.72,40.36 SL4.6 | R31.2 81.61,78.77 81.61,59.03 81.08,58.5 RESET.1 81.79,59.03 82.32,58.5 87.48,58.5 RESET.2
  Bottom 0.406: 77.34,57.43 80.01,57.43 80.9,58.32 RESET.1 | 77.34,57.43 74.85,57.43 73.61,58.67 72.9,58.67 C13.+ | 77.34,57.43 77.34,49.78 76.63,49.07 76.63,42.49 74.85,40.72 8085.36
RST_OUT  (via drill 0.61)
  Top 0.406: 8085.3 59.38,45.7 54.41,45.7 54.23,45.52 SL1.3 | v92.81,38.23 92.28,38.23 88.54,41.96 v84.81,41.96 | v77.7,44.09 76.1,44.09 75.74,44.45 66.5,44.45 62.94,48.01 v61.7,48.01
  Bottom 0.406: v92.81,38.23 101.52,38.23 PORTS-82C55A.35 | v84.81,41.96 84.1,41.96 81.97,44.09 v77.7,44.09 | v61.7,48.01 59.56,45.87 8085.3
S0
  Top 0.406: 8085.29 74.85,22.76 80.54,22.76 80.72,22.58 SL3.9
S1
  Top 0.406: 8085.33 74.85,32.89 80.54,32.89 80.72,32.72 SL4.3
SID  (via drill 0.61)
  Top 0.61: 8085.5 59.38,40.54 54.41,40.54 54.23,40.36 SL1.5 | v82.68,70.59 90.32,78.23 90.32,78.77 R8.1 | v70.94,60.45 v67.74,57.25 66.67,58.32 51.38,58.32 v50.32,57.25
  Bottom 0.61: SID.1 43.92,33.07 43.92,36.45 43.56,36.8 43.56,39.12 43.92,39.47 SID.2 44.09,39.65 44.98,40.54 44.98,45.16 C11.+ 45.16,45.52 45.16,52.09 v50.32,57.25 | v82.68,70.59 81.08,70.59 v70.94,60.45 | v67.74,57.25 67.74,45.34 63.12,40.72 59.56,40.72 8085.5
SID1  (via drill 0.61)
  Top 0.61: PUSH.1 107.75,20.45 107.75,26.85 PUSH.2 | v95.66,41.07 95.66,37.16 87.66,29.16 87.48,29.16 86.41,28.09 PORTS-82C55A.10 | v109.53,54.05 v102.41,54.05 | v109.53,41.78 108.46,40.72 108.46,39.29 113.79,33.96 114.5,33.96 R11.1
  Bottom 0.61: 115.21,24.71 109.88,24.71 107.75,26.85 PUSH.2 | 115.21,24.71 116.64,24.71 C18.+ | v95.66,41.07 95.66,47.3 v102.41,54.05 | v109.53,41.78 v109.53,54.05 | 115.21,24.71 115.21,33.25 114.68,33.78 R11.1
SOD  (via drill 0.61)
  Top 0.406: 8085.4 59.38,43.03 54.41,43.03 54.23,42.85 SL1.4 | v66.5,46.05 67.39,46.94 75.92,46.94 76.28,46.58 81.97,46.58 82.32,46.94 88.9,46.94 107.92,65.96 107.92,79.12 R9.2
  Bottom 0.406: v66.5,46.05 66.5,45.34 64.19,43.03 59.56,43.03 8085.4
TRAP  (via drill 0.61)
  Top 0.406: 8085.6 59.38,38.05 54.41,38.05 54.23,37.87 SL1.6 | v94.77,54.41 94.77,78.77 R5.2 | v66.32,38.05 v68.99,35.38
  Bottom 0.406: v94.77,54.41 94.77,41.78 89.79,36.8 82.32,36.8 81.97,36.45 78.77,36.45 75.92,39.29 72.9,39.29 v68.99,35.38 | v66.32,38.05 59.56,38.05 8085.6
VCC  (via drill 0.61)
  Top 0.61: C10.1 22.23,78.77 25.43,78.77 25.96,78.23 DECODER.16 | U$2.VBUS 7.64,85.7 8.71,85.7 11.91,88.9 C1.1 12.09,89.26 12.8,89.97 12.8,93.7 R34.2 | 8.36,73.25 4.09,73.25 U$1.1 | 8.36,73.25 11.38,76.28 C3.+ | ROM-58C256.28 9.42,65.43 8.89,64.9 6.93,64.9 C16.1 6.76,64.54 4.45,62.23 4.45,16.54 10.31,10.67 10.31,9.42 D4.A | ROM-58C256.27 11.91,65.61 9.78,65.61 ROM-58C256.28 | 8.36,73.25 8.53,73.08 8.53,66.67 9.42,65.79 ROM-58C256.28 | PORTS-82C55A.26 101.7,15.11 104.72,15.11 C9.1 104.9,15.29 104.9,28.63 v106.86,30.58 | v111.3,16.89 v114.15,16.89 | R14.2 106.86,41.78 106.86,38.05 R16.2 106.86,37.69 106.86,33.96 R11.2 | R32.1 103.3,86.59 101.17,86.59 99.57,84.99 91.92,84.99 90.5,86.41 R8.2 | C15.1 72.72,53.34 72.72,52.81 74.68,50.85 8085.40 74.68,50.49 80.72,50.49 SL4.10 | NOT.14 28.63,91.39 28.63,94.06 C7.1 28.8,94.23 36.45,94.23 36.8,94.59 R6.P$2 37.16,94.77 40.72,98.32 | 40.72,98.32 44.27,101.88 55.83,101.88 58.67,99.03 U$3.2 | 62.76,92.46 63.3,92.46 C4.2 | 62.76,92.46 59.92,95.3 43.74,95.3 40.72,98.32 | v43.92,58.32 43.92,49.07 43.56,48.72 43.56,44.63 46.05,42.14 46.05,28.63 C8.1 | v44.09,60.98 44.09,62.41 48.18,66.5 48.18,70.76 58.14,80.72 | 58.14,80.72 62.59,85.17 62.59,92.28 62.76,92.46 | 58.14,80.72 v61.87,76.99 | v75.92,92.28 81.61,86.59 R31.1
  Bottom 0.61: DECODER.6 38.76,70.59 38.76,75.74 40.01,76.99 40.01,79.48 39.29,80.19 28.09,80.19 26.14,78.23 DECODER.16 | R10.2 12.98,97.79 12.98,93.88 R34.2 | 13.34,78.94 13.34,78.23 11.56,76.45 C3.+ | 13.34,78.94 13.34,87.12 12.09,88.37 12.09,88.9 C1.1 | 13.34,78.94 22.05,78.94 C10.1 22.23,79.12 22.23,84.99 28.45,91.21 NOT.14 | v114.15,16.89 114.15,17.96 118.06,21.87 120.55,21.87 129.08,13.34 129.08,10.85 RB3.1 | v111.3,16.89 108.46,16.89 106.68,15.11 104.9,15.11 C9.1 | R14.2 106.86,41.96 106.86,45.52 R12.2 106.68,45.87 106.68,49.43 R13.2 106.68,49.78 106.68,63.83 110.41,67.56 110.41,79.83 103.48,86.77 R32.1 | R8.2 90.32,86.41 88.19,86.41 86.94,85.17 83.03,85.17 81.79,86.41 R31.1 | v106.86,30.58 106.86,33.78 R11.2 | C8.1 46.05,28.45 49.07,25.43 ADDLATCH.20 | v43.92,58.32 43.92,60.81 v44.09,60.98 | v61.87,76.99 61.87,66.5 72.54,55.83 72.54,53.52 C15.1 | v75.92,92.28 63.48,92.28 C4.2
WR  (via drill 0.61)
  Top 0.406: v46.58,55.12 46.58,51.03 51.03,46.58 57.96,46.58 58.32,46.94 62.94,46.94 71.3,38.58 71.3,32.36 72.72,30.94 72.72,30.05 74.68,28.09 8085.31
  Bottom 0.406: v46.58,55.12 46.58,61.7 45.52,62.76 27.74,62.76 25.96,64.54 25.96,70.41 DECODER.1 | SL4.1 80.72,27.74 75.03,27.74 74.85,27.91 8085.31
X1
  Top 0.406: 57.96,50.67 54.41,50.67 54.23,50.49 SL1.1 | 57.96,50.67 59.38,50.67 8085.1 | 57.96,50.67 57.96,55.47 Q2.1
X2
  Top 0.406: C2.1 50.67,54.05 50.67,51.38 54.05,48.01 SL1.2 54.05,48.18 59.38,48.18 8085.2
  Bottom 0.406: Q2.2 62.94,55.47 62.94,51.74 59.56,48.36 8085.2

### Text on the board
tNames: PASSWORD PROTECTED PIGGY-BANK | 81/EC/14 / 89/EC/14